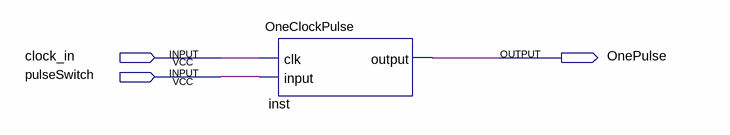
[diagram p0: schematic sheet]
// Quartus schematic StartPulseTest.bdf as structural Verilog: 1 symbols, 3 pins
module StartPulseTest (
  input  clock_in,
  input  pulseSwitch,
  output OnePulse
);

  OneClockPulse inst (.clk(clock_in), .\input (pulseSwitch), .\output (OnePulse));
endmodule
